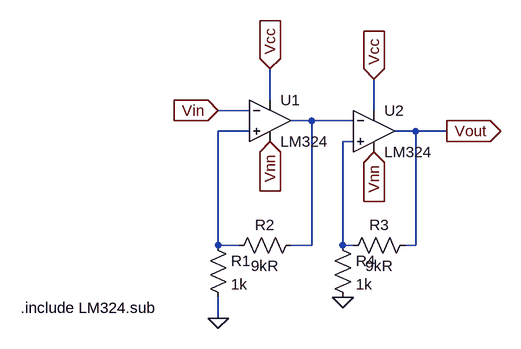
[diagram p0: schematic nonInvertCascade.asc]
nonInvertCascade.asc, the LTspice schematic file:
Version 4.1
SHEET 1 880 680
WIRE 192 80 192 32
WIRE 160 96 112 96
WIRE 352 96 352 48
WIRE 256 112 224 112
WIRE 320 112 256 112
WIRE 160 128 112 128
WIRE 416 128 384 128
WIRE 464 128 416 128
WIRE 320 144 304 144
WIRE 112 304 112 128
WIRE 144 304 112 304
WIRE 256 304 256 112
WIRE 256 304 224 304
WIRE 304 304 304 144
WIRE 320 304 304 304
WIRE 416 304 416 128
WIRE 416 304 400 304
WIRE 112 416 112 384
FLAG 112 416 0
FLAG 112 96 Vin
IOPIN 112 96 In
FLAG 464 128 Vout
IOPIN 464 128 Out
FLAG 192 144 Vnn
IOPIN 192 144 In
FLAG 192 32 Vcc
IOPIN 192 32 In
FLAG 352 48 Vcc
IOPIN 352 48 In
FLAG 352 160 Vnn
IOPIN 352 160 In
FLAG 304 384 0
SYMBOL LM324 192 112 R0
SYMATTR InstName U1
SYMBOL res 96 288 R0
SYMATTR InstName R1
SYMATTR Value 1k
SYMBOL res 240 288 R90
WINDOW 0 0 56 VBottom 2
WINDOW 3 32 56 VTop 2
SYMATTR InstName R2
SYMATTR Value 9kR
SYMBOL LM324 352 128 R0
SYMATTR InstName U2
SYMBOL res 416 288 R90
WINDOW 0 0 56 VBottom 2
WINDOW 3 32 56 VTop 2
SYMATTR InstName R3
SYMATTR Value 9kR
SYMBOL res 288 288 R0
SYMATTR InstName R4
SYMATTR Value 1k
TEXT -192 400 Left 2 !.include LM324.sub

The netlist it stands for:
* nonInvertCascade.asc
* U1: LM324 (symbol LM324 not available, pins judged from their places): In+=N002 In-=Vin V+=Vcc V-=Vnn OUT=N001
R1 N002 0 1k
R2 N001 N002 9kR
* U2: LM324 (symbol LM324 not available, pins judged from their places): In+=N003 In-=N001 V+=Vcc V-=Vnn OUT=Vout
R3 Vout N003 9kR
R4 N003 0 1k
.include LM324.sub
.backanno
.end